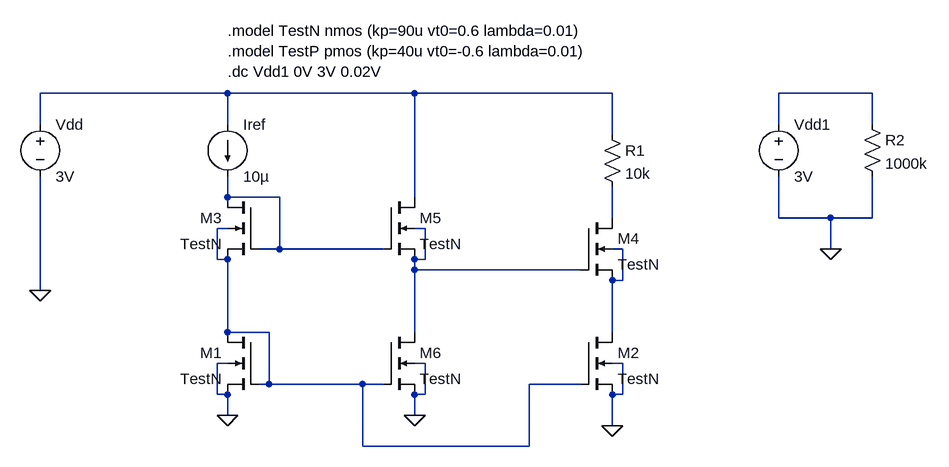
[diagram p0: schematic with_cascode_levelshift_2.asc]
with_cascode_levelshift_2.asc, the LTspice schematic file:
Version 4
SHEET 1 880 1464
WIRE -688 896 -976 896
WIRE -400 896 -688 896
WIRE -96 896 -400 896
WIRE 304 896 160 896
WIRE -976 944 -976 896
WIRE -688 944 -688 896
WIRE 160 944 160 896
WIRE 304 944 304 896
WIRE -96 960 -96 896
WIRE -688 1056 -688 1024
WIRE -608 1056 -688 1056
WIRE -400 1056 -400 896
WIRE -96 1088 -96 1040
WIRE 160 1088 160 1024
WIRE 240 1088 160 1088
WIRE 304 1088 304 1024
WIRE 304 1088 240 1088
WIRE -688 1104 -704 1104
WIRE -384 1104 -400 1104
WIRE -608 1136 -608 1056
WIRE -608 1136 -640 1136
WIRE -448 1136 -608 1136
WIRE -80 1136 -96 1136
WIRE 240 1136 240 1088
WIRE -704 1152 -704 1104
WIRE -688 1152 -704 1152
WIRE -384 1152 -384 1104
WIRE -384 1152 -400 1152
WIRE -400 1168 -400 1152
WIRE -144 1168 -400 1168
WIRE -80 1184 -80 1136
WIRE -80 1184 -96 1184
WIRE -976 1200 -976 1024
WIRE -688 1264 -688 1152
WIRE -624 1264 -688 1264
WIRE -400 1264 -400 1168
WIRE -96 1264 -96 1184
WIRE -688 1312 -704 1312
WIRE -384 1312 -400 1312
WIRE -80 1312 -96 1312
WIRE -624 1344 -624 1264
WIRE -624 1344 -640 1344
WIRE -480 1344 -624 1344
WIRE -448 1344 -480 1344
WIRE -144 1344 -224 1344
WIRE -704 1360 -704 1312
WIRE -688 1360 -704 1360
WIRE -384 1360 -384 1312
WIRE -384 1360 -400 1360
WIRE -80 1360 -80 1312
WIRE -80 1360 -96 1360
WIRE -688 1392 -688 1360
WIRE -400 1392 -400 1360
WIRE -96 1408 -96 1360
WIRE -480 1440 -480 1344
WIRE -224 1440 -224 1344
WIRE -224 1440 -480 1440
FLAG -688 1392 0
FLAG -976 1200 0
FLAG -96 1408 0
FLAG -400 1392 0
FLAG 240 1136 0
SYMBOL current -688 944 R0
WINDOW 123 0 0 Left 2
WINDOW 39 0 0 Left 2
SYMATTR InstName Iref
SYMATTR Value 10µ
SYMBOL voltage -976 928 R0
SYMATTR InstName Vdd
SYMATTR Value 3V
SYMBOL nmos4 -640 1264 M0
SYMATTR InstName M1
SYMATTR Value TestN
SYMATTR Value2 l=10u w=10u
SYMBOL nmos4 -144 1264 R0
SYMATTR InstName M2
SYMATTR Value TestN
SYMATTR Value2 l=10u w=100u
SYMBOL nmos4 -144 1088 R0
SYMATTR InstName M4
SYMATTR Value TestN
SYMATTR Value2 l=10u w=100u
SYMBOL nmos4 -640 1056 M0
SYMATTR InstName M3
SYMATTR Value TestN
SYMATTR Value2 l=40u w=10u
SYMBOL nmos4 -448 1056 R0
SYMATTR InstName M5
SYMATTR Value TestN
SYMATTR Value2 l=10u w=10u
SYMBOL nmos4 -448 1264 R0
SYMATTR InstName M6
SYMATTR Value TestN
SYMATTR Value2 l=10u w=10u
SYMBOL res -112 944 R0
SYMATTR InstName R1
SYMATTR Value 10k
SYMBOL voltage 160 928 R0
SYMATTR InstName Vdd1
SYMATTR Value 3V
SYMBOL res 288 928 R0
SYMATTR InstName R2
SYMATTR Value 1000k
TEXT -688 800 Left 2 !.model TestN nmos (kp=90u vt0=0.6 lambda=0.01)\n.model TestP pmos (kp=40u vt0=-0.6 lambda=0.01)\n.dc Vdd1 0V 3V 0.02V

The netlist it stands for:
* with_cascode_levelshift_2.asc
Iref N001 N003 10µ
Vdd N001 0 3V
M1 N005 N005 0 0 TestN l=10u w=10u
M2 N007 N005 0 0 TestN l=10u w=100u
M4 N004 N006 N007 N007 TestN l=10u w=100u
M3 N003 N003 N005 N005 TestN l=40u w=10u
M5 N001 N003 N006 N006 TestN l=10u w=10u
M6 N006 N005 0 0 TestN l=10u w=10u
R1 N001 N004 10k
Vdd1 N002 0 3V
R2 N002 0 1000k
.model NMOS NMOS
.model PMOS PMOS
.lib standard.mos
.model TestN nmos (kp=90u vt0=0.6 lambda=0.01)
.model TestP pmos (kp=40u vt0=-0.6 lambda=0.01)
.dc Vdd1 0V 3V 0.02V
.backanno
.end